# Altium schematic sheet AMU-S01-V00-Master.SchDoc
size A3; SheetNumber: 1; SheetTotal: 25
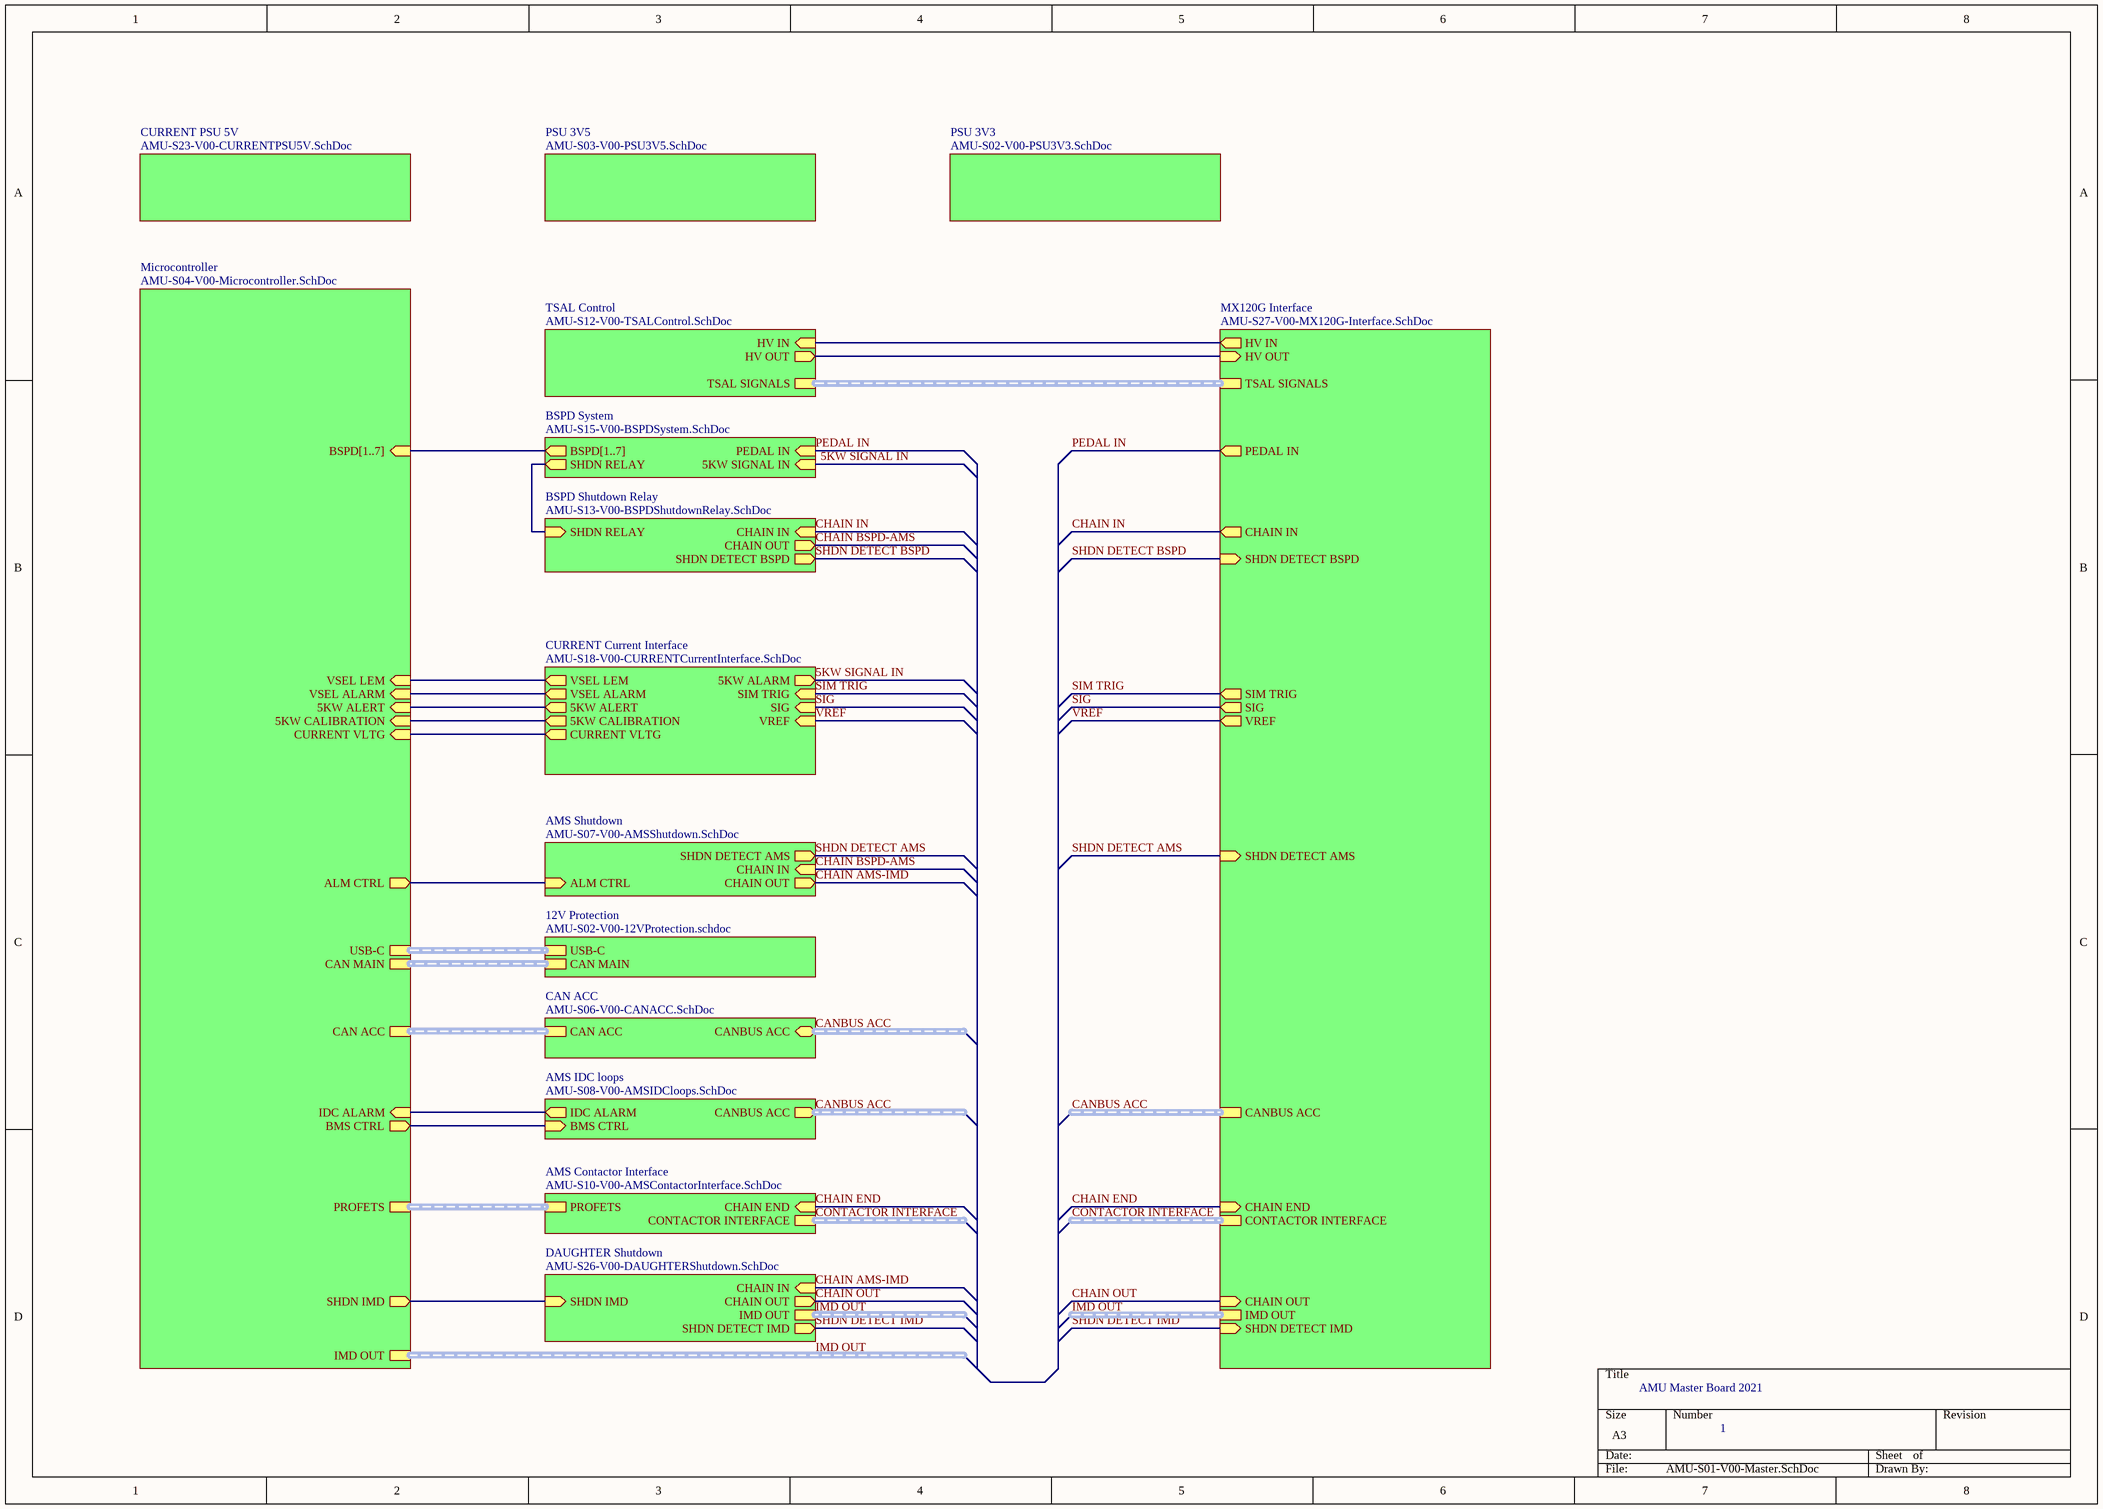
[diagram p0: AMU-S01-V00-Master.SchDoc]

## Sub-sheets
12V Protection = AMU-S02-V00-12VProtection.schdoc: USB-C (harness USB-C), CAN MAIN (harness CAN MAIN)
AMS Contactor Interface = AMU-S10-V00-AMSContactorInterface.SchDoc: PROFETS (harness PROFETS), CONTACTOR INTERFACE (harness CONTACTOR INTERFACE), CHAIN END (in)
AMS IDC loops = AMU-S08-V00-AMSIDCloops.SchDoc: IDC ALARM (out), BMS CTRL (in), CANBUS ACC (out, harness CANBUS4)
AMS Shutdown = AMU-S07-V00-AMSShutdown.SchDoc: ALM CTRL (in), CHAIN OUT (out), CHAIN IN (in), SHDN DETECT AMS (out)
BSPD Shutdown Relay = AMU-S13-V00-BSPDShutdownRelay.SchDoc: CHAIN OUT (out), CHAIN IN (in), SHDN RELAY (in), SHDN DETECT BSPD (out)
BSPD System = AMU-S15-V00-BSPDSystem.SchDoc: PEDAL IN (in), 5KW SIGNAL IN (in), SHDN RELAY (out), BSPD[1..7] (out)
CAN ACC = AMU-S06-V00-CANACC.SchDoc: CANBUS ACC (bidir, harness CANBUS4), CAN ACC (harness CAN4)
CURRENT Current Interface = AMU-S18-V00-CURRENTCurrentInterface.SchDoc: 5KW CALIBRATION (out), 5KW ALARM (out), CURRENT VLTG (out), 5KW ALERT (out), VSEL LEM (out), SIM TRIG (in), VSEL ALARM (out), SIG (in), VREF (in)
CURRENT PSU 5V = AMU-S23-V00-CURRENTPSU5V.SchDoc: no entries
DAUGHTER Shutdown = AMU-S26-V00-DAUGHTERShutdown.SchDoc: SHDN IMD (in), IMD OUT (harness IMD OUT), CHAIN OUT (out), CHAIN IN (in), SHDN DETECT IMD (out)
Microcontroller = AMU-S04-V00-Microcontroller.SchDoc: PROFETS (harness PROFETS), CAN MAIN (harness CAN MAIN), CAN ACC (harness CAN ACC), ALM CTRL (out), IDC ALARM (in), BMS CTRL (out), SHDN IMD (out), BSPD[1..7] (in), IMD OUT (harness IMD OUT), CURRENT VLTG (in), 5KW ALERT (in), VSEL ALARM (in), VSEL LEM (in), 5KW CALIBRATION (in), USB-C (harness USB-C)
MX120G Interface = AMU-S27-V00-MX120G-Interface.SchDoc: CANBUS ACC (harness CANBUS ACC), CONTACTOR INTERFACE (harness CONTACTOR INTERFACE), IMD OUT (harness IMD OUT), SIM TRIG (out), HV IN (out), HV OUT (in), CHAIN OUT (in), CHAIN IN (out), PEDAL IN (out), CHAIN END (in), TSAL SIGNALS (harness TSAL SIGNALS), SIG (out), VREF (out), SHDN DETECT BSPD (in), SHDN DETECT IMD (in), SHDN DETECT AMS (in)
PSU 3V3 = AMU-S02-V00-PSU3V3.SchDoc: no entries
PSU 3V5 = AMU-S03-V00-PSU3V5.SchDoc: no entries
TSAL Control = AMU-S12-V00-TSALControl.SchDoc: TSAL SIGNALS (harness TSAL SIGNALS), HV IN (in), HV OUT (out)

## Nets
5KW SIGNAL IN: sheet BSPD System/5KW SIGNAL IN, sheet CURRENT Current Interface/5KW ALARM
CHAIN AMS-IMD: sheet AMS Shutdown/CHAIN OUT, sheet DAUGHTER Shutdown/CHAIN IN
CHAIN BSPD-AMS: sheet AMS Shutdown/CHAIN IN, sheet BSPD Shutdown Relay/CHAIN OUT
CHAIN END: sheet AMS Contactor Interface/CHAIN END, sheet MX120G Interface/CHAIN END
CHAIN IN: sheet MX120G Interface/CHAIN IN, sheet BSPD Shutdown Relay/CHAIN IN
CHAIN OUT: sheet DAUGHTER Shutdown/CHAIN OUT, sheet MX120G Interface/CHAIN OUT
PEDAL IN: sheet MX120G Interface/PEDAL IN, sheet BSPD System/PEDAL IN
SHDN DETECT AMS: sheet AMS Shutdown/SHDN DETECT AMS, sheet MX120G Interface/SHDN DETECT AMS
SHDN DETECT BSPD: sheet MX120G Interface/SHDN DETECT BSPD, sheet BSPD Shutdown Relay/SHDN DETECT BSPD
SHDN DETECT IMD: sheet DAUGHTER Shutdown/SHDN DETECT IMD, sheet MX120G Interface/SHDN DETECT IMD
SIG: sheet MX120G Interface/SIG, sheet CURRENT Current Interface/SIG
SIM TRIG: sheet MX120G Interface/SIM TRIG, sheet CURRENT Current Interface/SIM TRIG
VREF: sheet MX120G Interface/VREF, sheet CURRENT Current Interface/VREF
(unnamed): sheet Microcontroller/ALM CTRL, sheet AMS Shutdown/ALM CTRL
(unnamed): sheet Microcontroller/IDC ALARM, sheet AMS IDC loops/IDC ALARM
(unnamed): sheet Microcontroller/BMS CTRL, sheet AMS IDC loops/BMS CTRL
(unnamed): sheet Microcontroller/SHDN IMD, sheet DAUGHTER Shutdown/SHDN IMD
(unnamed): sheet Microcontroller/CURRENT VLTG, sheet CURRENT Current Interface/CURRENT VLTG
(unnamed): sheet Microcontroller/5KW ALERT, sheet CURRENT Current Interface/5KW ALERT
(unnamed): sheet Microcontroller/VSEL ALARM, sheet CURRENT Current Interface/VSEL ALARM
(unnamed): sheet Microcontroller/VSEL LEM, sheet CURRENT Current Interface/VSEL LEM
(unnamed): sheet Microcontroller/5KW CALIBRATION, sheet CURRENT Current Interface/5KW CALIBRATION
(unnamed): sheet TSAL Control/HV IN, sheet MX120G Interface/HV IN
(unnamed): sheet TSAL Control/HV OUT, sheet MX120G Interface/HV OUT
(unnamed): sheet BSPD Shutdown Relay/SHDN RELAY, sheet BSPD System/SHDN RELAY

## Buses and harness runs
bus sheet BSPD System/BSPD[1..7] = sheet Microcontroller/BSPD[1..7]
harness CANBUS ACC = sheet AMS IDC loops/CANBUS ACC
harness CANBUS ACC = sheet CAN ACC/CANBUS ACC
harness CANBUS ACC = sheet MX120G Interface/CANBUS ACC
harness CONTACTOR INTERFACE = sheet AMS Contactor Interface/CONTACTOR INTERFACE
harness CONTACTOR INTERFACE = sheet MX120G Interface/CONTACTOR INTERFACE
harness IMD OUT = sheet DAUGHTER Shutdown/IMD OUT
harness IMD OUT = sheet Microcontroller/IMD OUT
harness IMD OUT = sheet MX120G Interface/IMD OUT
harness sheet 12V Protection/CAN MAIN = sheet Microcontroller/CAN MAIN
harness sheet 12V Protection/USB-C = sheet Microcontroller/USB-C
harness sheet AMS Contactor Interface/PROFETS = sheet Microcontroller/PROFETS
harness sheet CAN ACC/CAN ACC = sheet Microcontroller/CAN ACC
harness sheet MX120G Interface/TSAL SIGNALS = sheet TSAL Control/TSAL SIGNALS

## Notes on the sheet
- AMU Master Board 2021
- 1